# EAGLE design SD_BD_v2.1 (EAGLE 9.6.2)
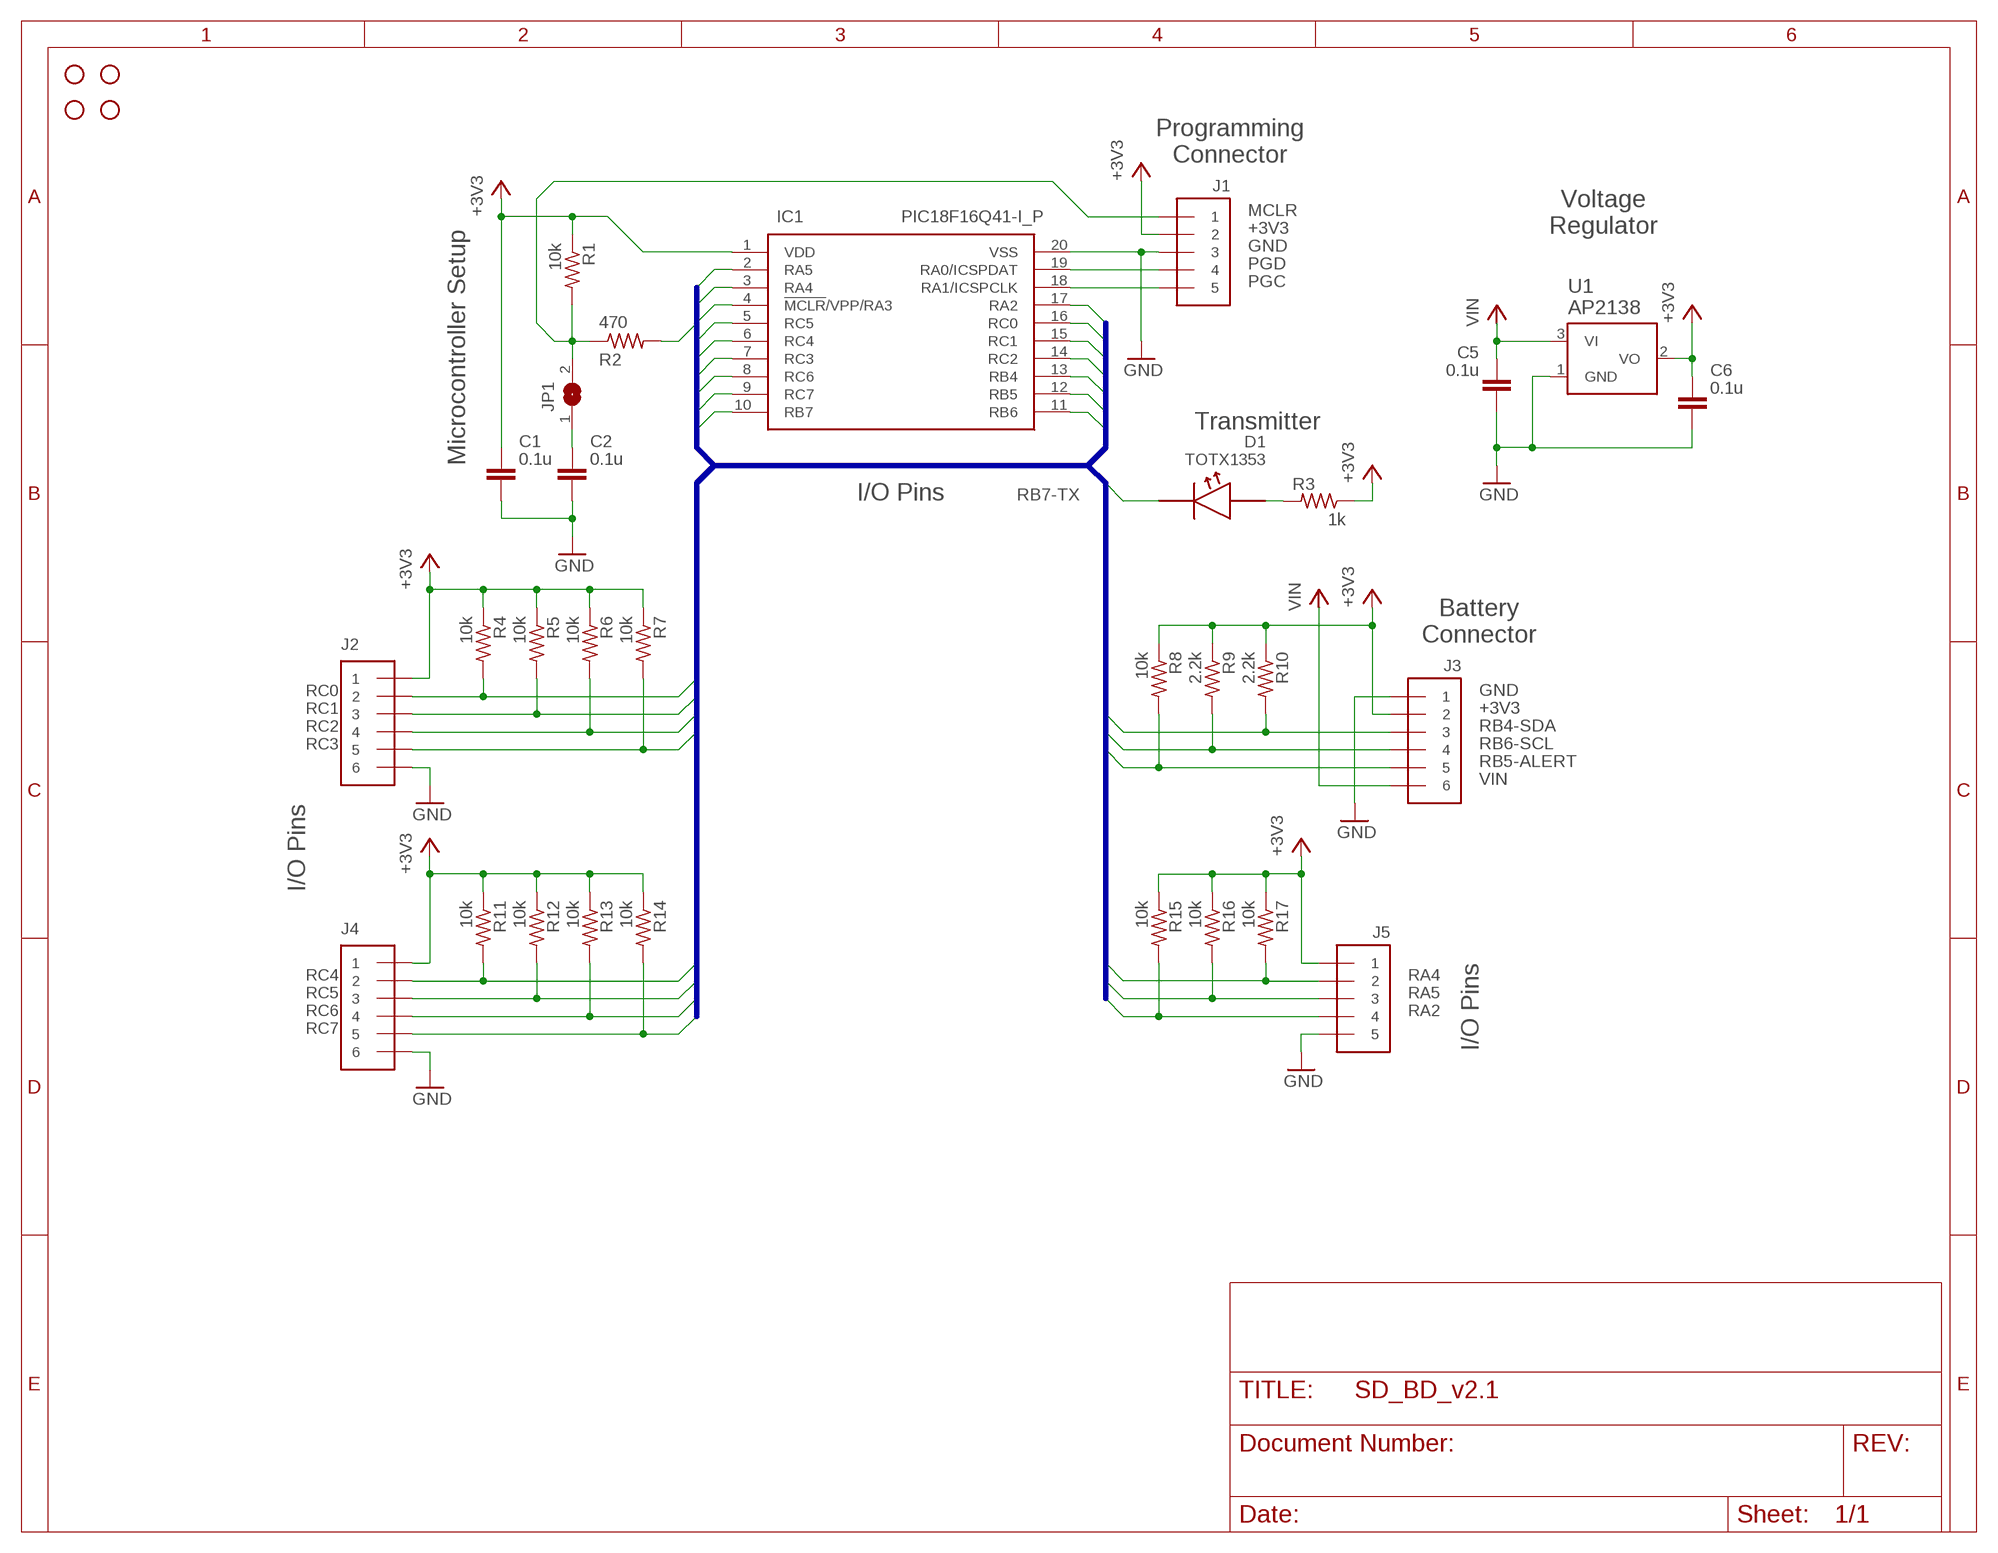
[diagram p0: schematic, sheet 1]

## Parts
C1  0.1u  C_CHIP-1206(3216-METRIC)  [CAPC3216X135]
C2  0.1u  C_CHIP-1206(3216-METRIC)  [CAPC3216X135]
C5  0.1u  C_CHIP-1206(3216-METRIC)  [CAPC3216X135]
C6  0.1u  C_CHIP-1206(3216-METRIC)  [CAPC3216X135]
D1  TOTX1353  [TOXX1353]
H1  STAND-OFF  [STAND-OFF]
H2  STAND-OFF  [STAND-OFF]
H3  STAND-OFF  [STAND-OFF]
H4  STAND-OFF  [STAND-OFF]
IC1  PIC18F16Q41-I_P  [DIP794W56P254L2591H533Q20N]
J1  M20-9990546  [HDR-5-M]
J2  PPTC061LFBN-RC  [HDR-6-F]
J3  PPTC061LFBN-RC  [HDR-6-F]
J4  PPTC061LFBN-RC  [HDR-6-F]
J5  PPTC051LFBN-RC  [HDR-5-F]
JP1  SJ  [SJ]
R1  10k  R-US_R1206  [R1206]
R2  470  R-US_R1206  [R1206]
R3  1k  R-US_R1206  [R1206]
R4  10k  R-US_R1206  [R1206]
R5  10k  R-US_R1206  [R1206]
R6  10k  R-US_R1206  [R1206]
R7  10k  R-US_R1206  [R1206]
R8  10k  R-US_R1206  [R1206]
R9  2.2k  R-US_R1206  [R1206]
R10  2.2k  R-US_R1206  [R1206]
R11  10k  R-US_R1206  [R1206]
R12  10k  R-US_R1206  [R1206]
R13  10k  R-US_R1206  [R1206]
R14  10k  R-US_R1206  [R1206]
R15  10k  R-US_R1206  [R1206]
R16  10k  R-US_R1206  [R1206]
R17  10k  R-US_R1206  [R1206]
U1  AP2138N-3.3TRG1IC3_AP2138N-3.3TRG1_DIO-M  [IC3_AP2138N-3.3TRG1_DIO-M]

## Nets
+3V3: C1.1 C6.1 IC1.1(VDD) J1.2 J2.1 J3.2 J4.1 J5.1 R1.1 R3.1 R4.1 R5.1 R6.1 R7.1 R8.1 R9.1 R10.1 R11.1 R12.1 R13.1 R14.1 R15.1 R16.1 R17.1 U1.2(VO)
GND: C1.2 C2.2 C5.2 C6.2 IC1.20(VSS) J1.3 J2.6 J3.1 J4.6 J5.5 U1.1(GND)
MCLR: J1.1 JP1.2 R1.2 R2.1
N$1: D1.3(A) R3.2
N$3: IC1.4(!MCLR!/VPP/RA3) R2.2
N$4: C2.1 JP1.1
PGC: IC1.18(RA1/ICSPCLK) J1.5
PGD: IC1.19(RA0/ICSPDAT) J1.4
RA2: IC1.17(RA2) J5.4 R15.2
RA4: IC1.3(RA4) J5.2 R17.2
RA5: IC1.2(RA5) J5.3 R16.2
RB4-SDA: IC1.13(RB4) J3.3 R10.2
RB5-ALERT: IC1.12(RB5) J3.5 R8.2
RB6-SCL: IC1.11(RB6) J3.4 R9.2
RB7-TX: D1.2(K) IC1.10(RB7)
RC0: IC1.16(RC0) J2.2 R4.2
RC1: IC1.15(RC1) J2.3 R5.2
RC2: IC1.14(RC2) J2.4 R6.2
RC3: IC1.7(RC3) J2.5 R7.2
RC4: IC1.6(RC4) J4.2 R11.2
RC5: IC1.5(RC5) J4.3 R12.2
RC6: IC1.8(RC6) J4.4 R13.2
RC7: IC1.9(RC7) J4.5 R14.2
VIN: C5.1 J3.6 U1.3(VI)
Unconnected: D1.1(NC1) D1.4(NC2) D1.5(NC3)

## Buses
RA2,RA4,RA5,RB4-SDA,RB5-ALERT,RB6-SCL,RB7-TX,RC0,RC1,RC2,RC3,RC4,RC5,RC6,RC7

## Notes on the sheet
- Programming
  Connector
- Voltage
  Regulator
- Transmitter
- Microcontroller Setup
- I/O Pins
- Battery
  Connector
- I/O Pins
- I/O Pins

## Library data of the parts
C1 C2 C5 C6 = Capacitor:C: Capacitor - Generic; CATEGORY: Capacitor
D1 = SD_LIB:TOTX1353
H1-H4 = SparkFun-Hardware:STAND-OFF: Stand Off Drill holes for mechanically mounting via screws, standoffs, etc. Note: Use the keepout ring to avoid running the screw head into surrounding components. Variant Overviews STAND-OFF - Mechanical footprint for a #4 phillips button head screw. STAND-OFF-TIGHT - Mechanical footprint for a #4 phillips button head screw, Example SparkFun Products Screw - Phillips Head (1/4", 4-40, 10 pack) <https://www.sparkfun.com/products/10453> (PRT-10453) Screw - Phillips Head (1/2", 4-40, 10 pack) <https://www.sparkfun.com/products/10452> (PRT-10452) Screw - Phillips Head (3/4", 4-40, 10 pack) <https://www.sparkfun.com/products/10451> (PRT-10451) Screw - Phillips Head (1", 4-40, 10 pack) <https://www.sparkfun.com/products/10450> (PRT-10450)
IC1 = SamacSys_Parts:PIC18F16Q41-I_P: Low-Power, High-Performance Microcontroller with XLP Technology Source: Datasheet <https://ww1.microchip.com/downloads/en/DeviceDoc/PIC18F06-16Q41-DataSheet-40002214C.pdf>; DESCRIPTION: Low-Power, High-Performance Microcontroller with XLP Technology; HEIGHT: 5.334mm; MANUFACTURER_NAME: Microchip; MANUFACTURER_PART_NUMBER: PIC18F16Q41-I/P; MOUSER_PART_NUMBER: 579-PIC18F16Q41-I/P; MOUSER_PRICE-STOCK: https://www.mouser.co.uk/ProductDetail/Microchip-Technology/PIC18F16Q41-I-P?qs=OlC7AqGiEDlx9Tzh3rj7Kg%3D%3D
J1 = SD_LIB:M20-9990546
J2-J4 = SD_LIB:PPTC061LFBN-RC
J5 = SD_LIB:PPTC051LFBN-RC
JP1 = jumper:SJ: SMD solder JUMPER
R1-R17 = resistor:R-US_: RESISTOR, American symbol
U1 = SD_LIB:AP2138N-3.3TRG1; COPYRIGHT: Copyright (C) 2022 Ultra Librarian. All rights reserved.; DIGI-KEY_PART_NUMBER_1: AP2138N-3.3TRG1DITR-ND; DIGI-KEY_PART_NUMBER_2: AP2138N-3.3TRG1DICT-ND; DIGI-KEY_PART_NUMBER_3: AP2138N-3.3TRG1DIDKR-ND; MANUFACTURER_PART_NUMBER: AP2138N-3.3TRG1; MFR_NAME: Diodes Inc

## Board
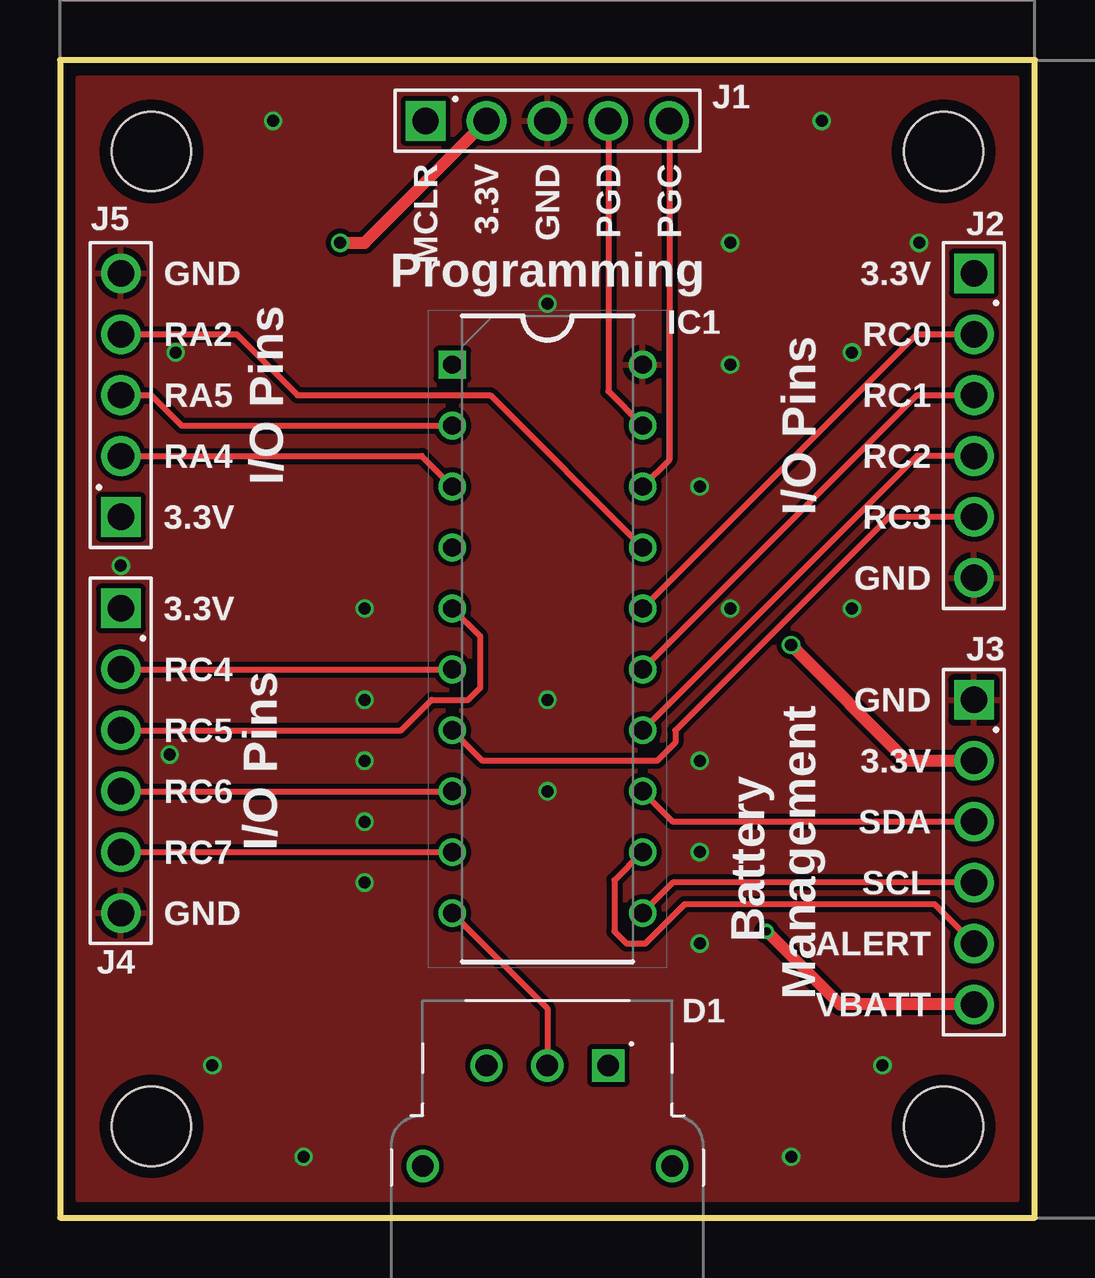
[diagram p1: board, top side]
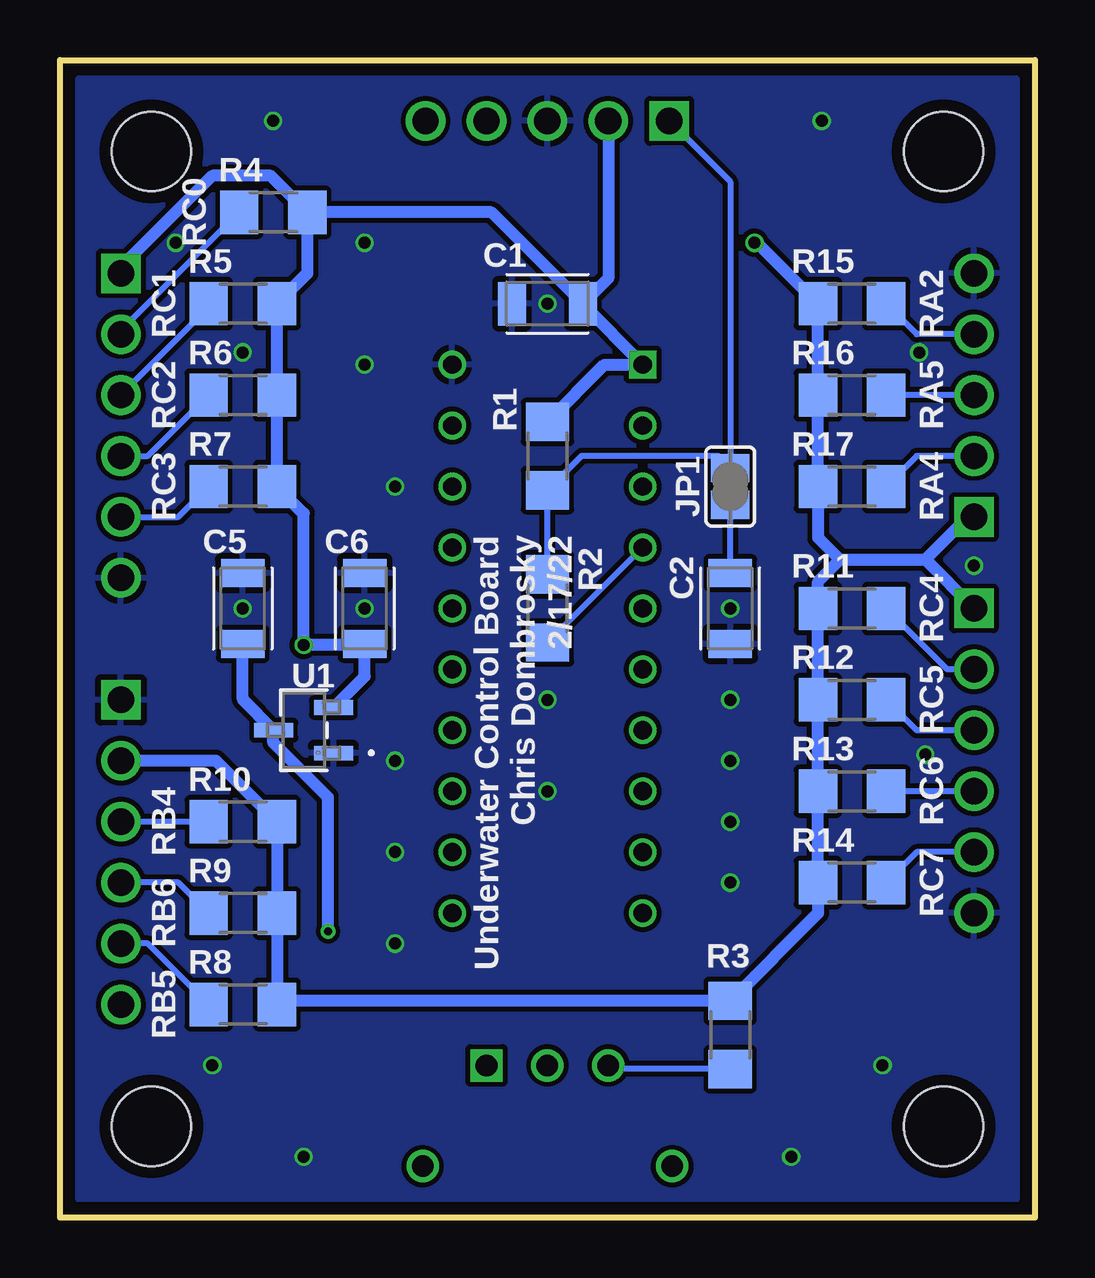
[diagram p2: board, bottom side, seen from below]

Size 40.64 x 48.26 mm. Coordinates in mm from the lower left corner, seen from the top.
Outline: 0,0 40.64,0 40.64,48.26 0,48.26 0,0
Copper layers (1*16): Top 0.035mm / dielectric 1.5mm / Bottom 0.035mm
Design rules "JLC *": minimum track width 5mil, minimum drill 0.28mm, track to track 8mil, track to pad 0.2mm, pad to pad 5mil, via to via 0.5mm, smd to smd 5mil, copper to edge 0.5mm, drill to drill 0.5mm, minimum pad ring 0.13mm, minimum via ring 0.13mm, stop-mask expansion 0.05mm, vias tented up to drill 20mil, thermal gap 10mil

### Footprints (pad centres in the part's own frame; a part is rotated, then mirrored left to right if it is on the bottom)
CAPC3216X135 = smd 1.165 x 1.815: 1 -1.475,0; 2 1.475,0
TOXX1353 = drill 0.9 square: 1 -2.54,0 | drill 0.9: 2 0,0; 3 2.54,0; 4 5.2,4.2; 5 -5.2,4.2
STAND-OFF = hole 3.302: 0,0
DIP794W56P254L2591H533Q20N = drill 0.759 pad 1.159 square: 1 -3.969,11.43 | drill 0.759 pad 1.159: 2 -3.969,8.89; 3 -3.969,6.35; 4 -3.969,3.81; 5 -3.969,1.27; 6 -3.969,-1.27; 7 -3.969,-3.81; 8 -3.969,-6.35; 9 -3.969,-8.89; 10 -3.969,-11.43; 11 3.969,-11.43; 12 3.969,-8.89; 13 3.969,-6.35; 14 3.969,-3.81; 15 3.969,-1.27; 16 3.969,1.27; 17 3.969,3.81; 18 3.969,6.35; 19 3.969,8.89; 20 3.969,11.43
HDR-5-M = drill 1.1 square: 1 0,0 | drill 1.1: 2 2.54,0; 3 5.08,0; 4 7.62,0; 5 10.16,0
HDR-6-F = drill 1.1 square: 1 1.27,1.27 | drill 1.1: 2 3.81,1.27; 3 6.35,1.27; 4 8.89,1.27; 5 11.43,1.27; 6 13.97,1.27
HDR-5-F = drill 1.1 square: 1 1.27,1.27 | drill 1.1: 2 3.81,1.27; 3 6.35,1.27; 4 8.89,1.27; 5 11.43,1.27
SJ = smd 1.168 x 1.6: 1 -0.762,0; 2 0.762,0
R1206 = smd 1.6 x 1.803: 1 -1.422,0; 2 1.422,0
IC3_AP2138N-3.3TRG1_DIO-M = smd 0.61 x 1.626: 1 -0.953,-1.245; 2 0.953,-1.245; 3 0,1.245

### Placement (x,y rotation side)
C1  20.32,38.1 180 bottom
C2  12.7,25.4 270 bottom
C5  33.02,25.4 90 bottom
C6  27.94,25.4 90 bottom
D1  20.32,6.35 180 top
H1  3.81,44.45 0 top
H2  36.83,44.45 0 top
H3  3.81,3.81 0 top
H4  36.83,3.81 0 top
IC1  20.32,24.13 0 top
J1  15.24,45.72 0 top
J2  36.83,40.64 270 top
J3  36.83,22.86 270 top
J4  1.27,26.67 270 top
J5  3.81,27.94 90 top
JP1  12.7,30.48 90 bottom
R1  20.32,31.75 270 bottom
R2  20.32,25.4 270 bottom
R3  12.7,7.62 270 bottom
R4  31.75,41.91 180 bottom
R5  33.02,38.1 180 bottom
R6  33.02,34.29 180 bottom
R7  33.02,30.48 180 bottom
R8  33.02,8.89 180 bottom
R9  33.02,12.7 180 bottom
R10  33.02,16.51 180 bottom
R11  7.62,25.4 0 bottom
R12  7.62,21.59 0 bottom
R13  7.62,17.78 0 bottom
R14  7.62,13.97 0 bottom
R15  7.62,38.1 0 bottom
R16  7.62,34.29 0 bottom
R17  7.62,30.48 0 bottom
U1  30.48,20.32 90 bottom

### Tracks (layer width: path | path; a pad name or v marks a point on that pad's centre or on a via)
+3V3  (via drill 0.5, 0.51)
  Top 0.508: J3.2 35.31,19.05 v30.48,23.88 | v11.68,40.64 12.7,40.64 J1.2
  Bottom 0.508: U1.2 27.94,22.57 C6.1 27.99,23.88 v30.48,23.88 30.48,29.36 R7.1 R6.1 R5.1 30.33,39.37 R4.1 | J1.2 17.78,39.16 C1.1 | C1.1 18.84,38.05 IC1.1 17.93,35.56 R1.1 | J3.2 34.14,19.05 R10.1 R9.1 R8.1 31.45,9.04 R3.1 9.04,12.7 R14.1 R13.1 R12.1 R11.1 9.04,26.52 8.13,27.43 | 8.13,27.43 4.57,27.43 | 4.57,27.43 J4.1 | J5.1 2.79,29.21 4.57,27.43 | 8.13,27.43 9.04,28.35 R17.1 R16.1 R15.1 11.58,40.64 v11.68,40.64 | R4.1 22.66,41.91 C1.1 | R4.1 31.85,43.43 34.29,43.43 38.1,39.62 J2.1
GND  (via drill 0.5)
  other vias: 10.16,2.54 30.48,2.54 6.35,6.35 34.29,6.35 26.67,11.43 26.67,15.24 26.67,19.05 26.67,30.48 27.94,35.56 12.7,21.59 12.7,19.05 12.7,16.51 12.7,13.97 8.89,45.72 31.75,45.72 27.94,40.64 20.32,17.78 20.32,21.59 4.57,19.3 2.54,27.18 4.83,36.07 33.02,36.07 27.94,25.4 33.02,25.4 20.32,38.1 12.7,25.4 35.81,40.64
  pour Bottom: 0.76,47.5 0.76,0.76 39.88,0.76 39.88,47.5
  pour Top: 39.88,47.5 39.88,0.76 0.76,0.76 0.76,47.5
MCLR
  Bottom 0.254: R2.1 R1.2 18.9,31.75 13.21,31.75 JP1.2 12.7,43.18 J1.1
N$1
  Bottom 0.254: R3.2 17.63,6.2 D1.3
N$3
  Bottom 0.254: IC1.4 R2.2
N$4
  Bottom 0.254: C2.1 JP1.1
PGC
  Top 0.254: J1.5 25.4,31.59 IC1.18
PGD
  Top 0.254: J1.4 22.86,34.45 IC1.19
RA2
  Top 0.254: J5.4 7.37,36.83 9.91,34.29 17.94,34.29 IC1.17
  Bottom 0.254: J5.4 4.93,36.83 R15.2
RA4
  Top 0.254: J5.2 15.08,31.75 IC1.3
  Bottom 0.254: J5.2 4.93,31.75 R17.2
RA5
  Top 0.254: J5.3 3.81,34.29 5.08,33.02 IC1.2
  Bottom 0.254: J5.3 R16.2
RB4-SDA
  Top 0.254: J3.3 31.5,16.51 25.56,16.51 IC1.13
  Bottom 0.254: R10.2 J3.3
RB5-ALERT
  Top 0.254: IC1.12 23.11,14.07 23.11,11.94 23.62,11.43 24.4,11.43 26.04,13.07 36.46,13.07 J3.5
  Bottom 0.254: R8.2 36.98,11.43 J3.5
RB6-SCL
  Top 0.254: J3.4 25.56,13.97 IC1.11
  Bottom 0.254: R9.2 35.71,13.97 J3.4
RB7-TX
  Top 0.254: IC1.10 20.32,8.73 D1.2
RC0
  Top 0.254: IC1.16 35.72,36.83 J2.2
  Bottom 0.254: R4.2 38.1,36.98 J2.2
RC1
  Top 0.254: IC1.15 35.72,34.29 J2.3
  Bottom 0.254: J2.3 34.44,37.95 R5.2
RC2
  Top 0.254: J2.4 35.72,31.75 IC1.14
  Bottom 0.254: J2.4 36.98,31.75 R6.2
RC3
  Top 0.254: IC1.7 17.62,19.05 24.89,19.05 25.65,19.81 25.65,20.32 34.54,29.21 J2.5
  Bottom 0.254: J2.5 35.71,29.21 R7.2
RC4
  Top 0.254: J4.2 IC1.6
  Bottom 0.254: J4.2 3.66,22.86 R11.2
RC5
  Top 0.254: J4.3 14.22,20.32 15.49,21.59 17.02,21.59 17.53,22.1 17.53,24.23 IC1.5
  Bottom 0.254: J4.3 4.93,20.32 R12.2
RC6
  Top 0.254: J4.4 IC1.8
  Bottom 0.254: J4.4 R13.2
RC7
  Top 0.254: J4.5 IC1.9
  Bottom 0.254: J4.5 4.93,15.24 R14.2
VIN  (via drill 0.35)
  Top 0.508: J3.6 32.51,8.89 v29.46,11.94
  Bottom 0.508: C5.1 33.02,21.62 U1.3 31.75,20.29 31.75,19.81 29.46,17.53 v29.46,11.94

### Text on the board
bPlace: Underwater Control Board / Chris Dombrosky / 2/17/22
tNames: MCLR | 3.3V | GND | PGD | PGC | Programming | GND | 3.3V | RA2 | RC0 | RA5 | I/O Pins | RC1 | I/O Pins | RA4 | RC2 | 3.3V | RC3 | GND | 3.3V | RC4 | GND | RC5 | I/O Pins | 3.3V | RC6 | SDA | RC7 | Battery / Management | SCL | GND | ALERT | VBATT
bNames: RC0 | RA2 | RC1 | RA5 | RC2 | RA4 | RC3 | RC4 | U1 | RC5 | RC6 | RB4 | RC7 | RB6 | RB5